# Altium project pay-optical.PrjPCB
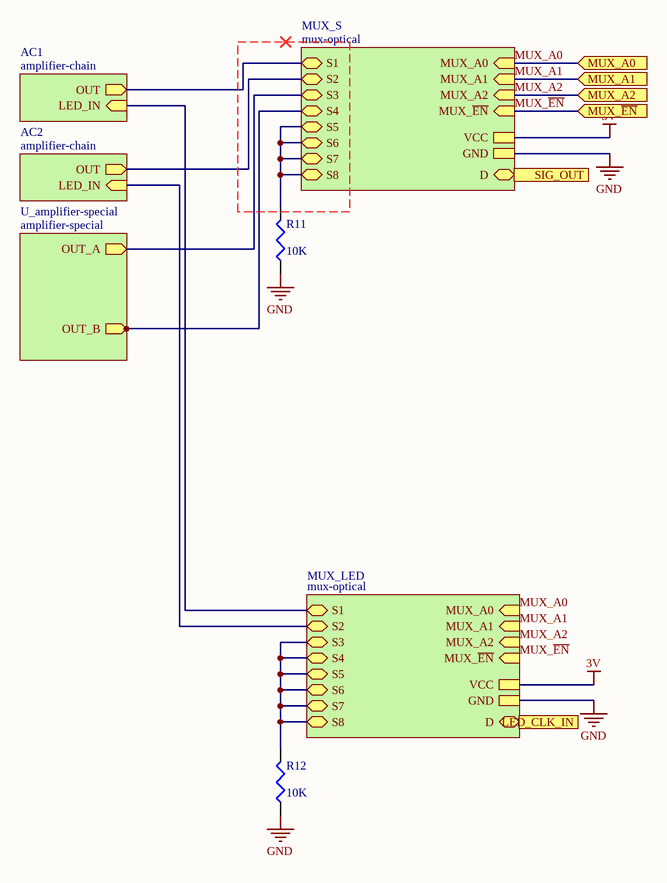
[diagram p0: filtering-optical-special.SchDoc]
4 sheets, 40 parts. Net scope: hierarchical (ports join the sheet entries above them; power ports are global).
Board file: pay-optical.PcbDoc
Sheets:
  filtering-optical-special.SchDoc
    AC1 = amplifier-chain.SchDoc
    AC2 = amplifier-chain.SchDoc
    MUX_LED = mux-optical.SchDoc
    MUX_S = mux-optical.SchDoc
    U_amplifier-special = amplifier-special.SchDoc

## Sheet filtering-optical-special.SchDoc
size A4

### Parts
R11  10K  [0402]
R12  10K  [0402]

### Sub-sheets
AC1 = amplifier-chain: OUT (out), LED_IN (in)
AC2 = amplifier-chain: OUT (out), LED_IN (in)
MUX_LED = mux-optical: MUX_A0 (in), MUX_A1 (in), MUX_A2 (in), MUX_~{EN} (in), VCC, GND, S1 (bidir), S2 (bidir), S3 (bidir), S4 (bidir), S5 (bidir), S6 (bidir), S7 (bidir), S8 (bidir), D (bidir)
MUX_S = mux-optical: MUX_A0 (in), MUX_A1 (in), MUX_A2 (in), MUX_~{EN} (in), VCC, GND, S1 (bidir), S2 (bidir), S3 (bidir), S4 (bidir), S5 (bidir), S6 (bidir), S7 (bidir), S8 (bidir), D (bidir)
U_amplifier-special = amplifier-special: OUT_B (out), OUT_A (out)

### Ports
LED_CLK_IN (in), MUX_A0 (in), MUX_A1 (in), MUX_A2 (in), MUX_~{EN} (in), SIG_OUT (out)

### Nets
3V: sheet MUX_LED/VCC, sheet MUX_S/VCC
GND: R11.1 R12.1 ; sheet MUX_LED/GND, sheet MUX_S/GND
MUX_A0: port MUX_A0, sheet MUX_LED/MUX_A0, sheet MUX_S/MUX_A0
MUX_A1: port MUX_A1, sheet MUX_LED/MUX_A1, sheet MUX_S/MUX_A1
MUX_A2: port MUX_A2, sheet MUX_LED/MUX_A2, sheet MUX_S/MUX_A2
MUX_~{EN}: port MUX_~{EN}, sheet MUX_LED/MUX_~{EN}, sheet MUX_S/MUX_~{EN}
NetC17_AC83_2: sheet AC2/OUT, sheet MUX_S/S2
NetC17_AC84_2: sheet AC1/OUT, sheet MUX_S/S1
NetC18_1: sheet MUX_S/S4, sheet U_amplifier-special/OUT_B
NetR8_AC83_1: sheet AC2/LED_IN, sheet MUX_LED/S2
NetR8_AC84_1: sheet AC1/LED_IN, sheet MUX_LED/S1
NetR11_2: R11.2 ; sheet MUX_S/S5, sheet MUX_S/S6, sheet MUX_S/S7, sheet MUX_S/S8
NetR12_2: R12.2 ; sheet MUX_LED/S3, sheet MUX_LED/S4, sheet MUX_LED/S5, sheet MUX_LED/S6, sheet MUX_LED/S7, sheet MUX_LED/S8
NetU3_1: sheet MUX_S/S3, sheet U_amplifier-special/OUT_A
NetU12_MUX_LED2_3: port SIG_OUT, sheet MUX_S/D
NetU12_MUX_S3_3: port LED_CLK_IN, sheet MUX_LED/D

### Library data of the parts
R11 R12 = Res3: Resistor; Published: 8-Jun-2000; LatestRevisionDate: 29-May-2009; LatestRevisionNote: IPC-7351 Footprint Added.; PackageReference: J1-0603; Publisher: Altium Limited; PackageDescription: Chip Resistor; Value: 10K

## Sheet amplifier-chain.SchDoc: AMPLIFIER-OPTICAL
size A4; DrawnBy: Dylan Vogel; Organization: UTAT SS; DocumentNumber: 7; Revision: 1; SheetNumber: 7; SheetTotal: 7
Used 2 times, as channels AC1, AC2. Parts and nets are listed once, with the designators drawn on the sheet.
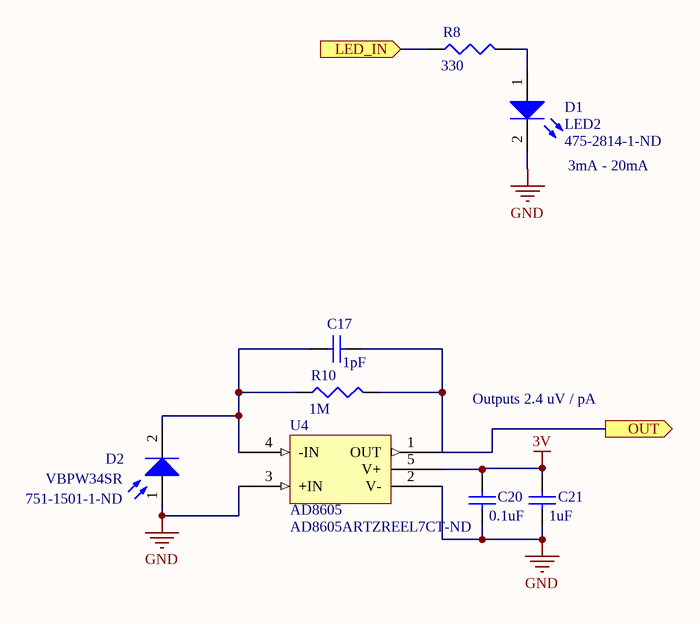
[diagram p1: amplifier-chain.SchDoc]

### Parts
C17  1pF  [0402]
C20  0.1uF  [0402]
C21  1uF  [1608[0603]]
D1  LED2  Supplier Part Number: 475-2814-1-ND  [LB P4SG]
D2  VBPW34SR  Supplier Part Number: 751-1501-1-ND  [VBPW34SR]
R8  330  [0402]
R10  1M  [J1-0603]
U4  AD8605  Supplier Part Number 1: AD8605ARTZREEL7CT-ND  [SOP-65P200X125-5N]

### Ports
LED_IN (in), OUT (out)

### Nets
3V: C20.2 C21.2 U4.5(V+)
GND: C20.1 C21.1 D1.2(K) D2.1(A) U4.2(V-) U4.3(+IN)
LED_IN: R8.1 ; port LED_IN
OUT: C17.2 R10.2 U4.1(OUT) ; port OUT
NetC17_1: C17.1 D2.2(K) R10.1 U4.4(-IN)
NetD1_1: D1.1(A) R8.2

### Channels
AC1: designators C17=C17_AC84 C20=C20_AC84 C21=C21_AC84 D1=D1_AC33 D2=D2_AC43 R8=R8_AC84 R10=R10_AC84 U4=U4_AC23; ports LED_IN=NetR8_AC84_1 OUT=NetC17_AC84_2
AC2: designators C17=C17_AC83 C20=C20_AC83 C21=C21_AC83 D1=D1_AC25 D2=D2_AC84 R8=R8_AC83 R10=R10_AC83 U4=U4_AC84; ports LED_IN=NetR8_AC83_1 OUT=NetC17_AC83_2

### Notes on the sheet
- (near D1) 3mA - 20mA
- Outputs 2.4 uV / pA

### Library data of the parts
C17 C20 C21 = Cap Semi: Capacitor (Semiconductor SIM Model); Published: 8-Jun-2000; LatestRevisionDate: 29-May-2009; LatestRevisionNote: IPC-7351 Footprint Added.; PackageReference: C1206; Publisher: Altium Limited; PackageDescription: Chip Capacitor; Supplier: Digi-Key
  C17: Value: 1pF
  C20: Value: 0.1uF
  C21: Value: 1uF
D1 = LED2: Typical RED, GREEN, YELLOW, AMBER GaAs LED; Published: 8-Jun-2000; LatestRevisionDate: 17-Jul-2002; LatestRevisionNote: Re-released for DXP Platform.; PackageVersion: Feb-2002; PackageReference: 3.2X1.6X1.1; Publisher: Altium Limited; PackageDescription: SM LED; 2 Flat Leads; Supplier: Digi-Key
D2 = Photo Sen: Photosensitive Diode; Published: 24-Mar-1999; LatestRevisionDate: 17-Jul-2002; LatestRevisionNote: Re-released for DXP Platform.; PackageReference: PIN2; Publisher: Altium Limited; Supplier: Digi-Key
R8 R10 = Res3: Resistor; Published: 8-Jun-2000; LatestRevisionDate: 29-May-2009; LatestRevisionNote: IPC-7351 Footprint Added.; PackageReference: J1-0603; Publisher: Altium Limited; PackageDescription: Chip Resistor; Supplier: Digi-Key
  R8: Value: 330
  R10: Value: 1M
U4 = AD8605: Low noise, precision rail-to-rail op-amp.; Supplier 1: Digi-Key; Supplier: Digi-Key

## Sheet mux-optical.SchDoc: MUX-OPTICAL
size A4; DrawnBy: Dylan Vogel; Organization: UTAT SS; DocumentNumber: 6; Revision: 1; SheetNumber: 6; SheetTotal: 7
Used 2 times, as channels MUX_LED, MUX_S. Parts and nets are listed once, with the designators drawn on the sheet.
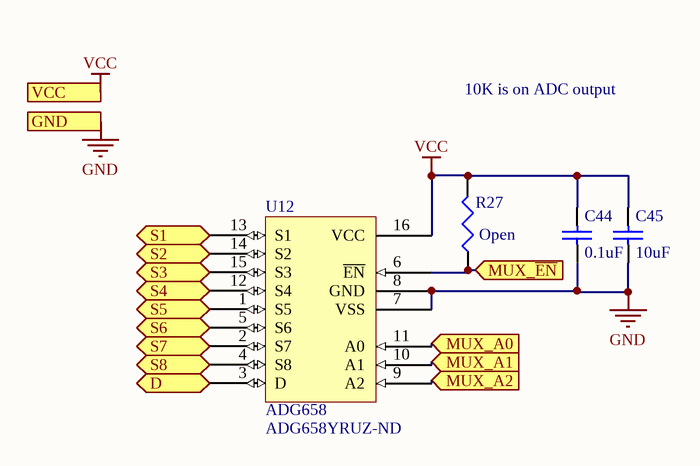
[diagram p2: mux-optical.SchDoc]

### Parts
C44  0.1uF  [0402]
C45  10uF  [1608[0603]]
R27  Open  [0402]
U12  ADG658  Supplier Part Number 1: ADG658YRUZ-ND  [SSOP16_N]

### Ports
D (bidir), GND, MUX_A0 (in), MUX_A1 (in), MUX_A2 (in), MUX_~{EN} (in), S1 (bidir), S2 (bidir), S3 (bidir), S4 (bidir), S5 (bidir), S6 (bidir), S7 (bidir), S8 (bidir), VCC

### Nets
GND: C44.1 C45.1 U12.7(VSS) U12.8(GND) ; port GND
VCC: C44.2 C45.2 R27.2 U12.16(VCC) ; port VCC
D: U12.3(D) ; port D
MUX_A0: U12.11(A0) ; port MUX_A0
MUX_A1: U12.10(A1) ; port MUX_A1
MUX_A2: U12.9(A2) ; port MUX_A2
MUX_~{EN}: R27.1 U12.6(~{EN}) ; port MUX_~{EN}
S1: U12.13(S1) ; port S1
S2: U12.14(S2) ; port S2
S3: U12.15(S3) ; port S3
S4: U12.12(S4) ; port S4
S5: U12.1(S5) ; port S5
S6: U12.5(S6) ; port S6
S7: U12.2(S7) ; port S7
S8: U12.4(S8) ; port S8

### Channels
MUX_LED: designators C44=C44_MUX_S4 C45=C45_MUX_LED4 R27=R27_MUX_S4 U12=U12_MUX_S3; ports D=NetU12_MUX_S3_3 GND=GND MUX_A0=MUX_A0 MUX_A1=MUX_A1 MUX_A2=MUX_A2 MUX_~{EN}=MUX_~{EN} S1=NetR8_AC84_1 S2=NetR8_AC83_1 S3=NetR12_2 S4=NetR12_2 S5=NetR12_2 S6=NetR12_2 S7=NetR12_2 S8=NetR12_2 VCC=3V
MUX_S: designators C44=C44_MUX_S5 C45=C45_MUX_S5 R27=R27_MUX_S2 U12=U12_MUX_LED2; ports D=NetU12_MUX_LED2_3 GND=GND MUX_A0=MUX_A0 MUX_A1=MUX_A1 MUX_A2=MUX_A2 MUX_~{EN}=MUX_~{EN} S1=NetC17_AC84_2 S2=NetC17_AC83_2 S3=NetU3_1 S4=NetC18_1 S5=NetR11_2 S6=NetR11_2 S7=NetR11_2 S8=NetR11_2 VCC=3V

### Notes on the sheet
- 10K is on ADC output

### Library data of the parts
C44 C45 = Cap Semi: Capacitor (Semiconductor SIM Model); Published: 8-Jun-2000; LatestRevisionDate: 29-May-2009; LatestRevisionNote: IPC-7351 Footprint Added.; PackageReference: C1206; Publisher: Altium Limited; PackageDescription: Chip Capacitor; Supplier: Digi-Key
  C44: Value: 0.1uF
  C45: Value: 10uF
R27 = Res3: Resistor; Published: 8-Jun-2000; LatestRevisionDate: 29-May-2009; LatestRevisionNote: IPC-7351 Footprint Added.; PackageReference: J1-0603; Publisher: Altium Limited; PackageDescription: Chip Resistor; Value: Open; Supplier: Digi-Key
U12 = ADG658: Eight channel analog multiplexer.; Supplier 1: Digi-Key; Supplier: Digi-Key

## Sheet amplifier-special.SchDoc
size A4
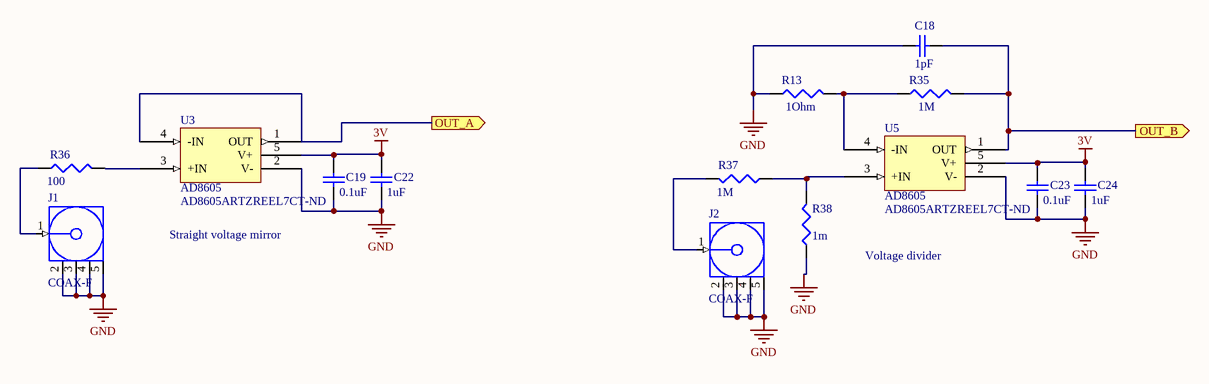
[diagram p3: amplifier-special.SchDoc]

### Parts
C18  value 1pF  [0402]  (hidden comment: 0.1uF)
C19  0.1uF  [0402]
C22  1uF  [1608[0603]]
C23  0.1uF  [0402]
C24  1uF  [1608[0603]]
J1  COAX-F  [MCX5.08-H5]
J2  COAX-F  [MCX5.08-H5]
R13  value 1Ohm  [J1-0603]  (hidden comment: 1 Ohm)
R35  1M  [0402]
R36  100  [0402]
R37  1M  [0402]
R38  1m  [14-1210]
U3  AD8605  Supplier Part Number 1: AD8605ARTZREEL7CT-ND  [SOP-65P200X125-5N]
U5  AD8605  Supplier Part Number 1: AD8605ARTZREEL7CT-ND  [SOP-65P200X125-5N]

### Ports
OUT_A (out), OUT_B (out)

### Nets
3V: C19.2 C22.2 C23.2 C24.2 U3.5(V+) U5.5(V+)
GND: C18.2 C19.1 C22.1 C23.1 C24.1 J1.2(GND) J1.3(GND) J1.4(GND) J1.5(GND) J2.2(GND) J2.3(GND) J2.4(GND) J2.5(GND) R13.1 R38.1 U3.2(V-) U5.2(V-)
NetC18_1: C18.1 R35.2 U5.1(OUT) ; port OUT_B
NetJ1_1: J1.1(Signal) R36.1
NetJ2_1: J2.1(Signal) R37.2
NetR13_2: R13.2 R35.1 U5.4(-IN)
NetR36_2: R36.2 U3.3(+IN)
NetR37_1: R37.1 R38.2 U5.3(+IN)
NetU3_1: U3.1(OUT) U3.4(-IN) ; port OUT_A

### Notes on the sheet
- Straight voltage mirror
- Voltage divider

### Library data of the parts
C18 C19 C22-C24 = Cap Semi: Capacitor (Semiconductor SIM Model); Published: 8-Jun-2000; LatestRevisionDate: 29-May-2009; LatestRevisionNote: IPC-7351 Footprint Added.; PackageReference: C1206; Publisher: Altium Limited; PackageDescription: Chip Capacitor; Supplier: Digi-Key
  C19 C23: Value: 0.1uF
  C22 C24: Value: 1uF
J1 J2 = COAX-F: RF Coaxial PCB Connector, MCX; Thru-Hole, Right-Angle Mount Socket, Blunt Post Terminal, 50 Ohm Impedance; PCB_Layout: Complies with manufacturer's recommendation.; DrillSize: Corresponds to nominal value.; Published: 15-Jul-2004; LatestRevisionDate: 15-Jul-2004; LatestRevisionNote: Component Replaced.; DatasheetDocument: 30-May-2003; PackageDocument: 04-Jul-1999; PackageReference: 919-119J-51AX; Publisher: Altium Limited; ComponentLink1Description: Manufacturer Link; ComponentLink1URL: http://www.amphenolrf.com/
R13 R35-R38 = Res3: Resistor; Published: 8-Jun-2000; LatestRevisionDate: 29-May-2009; LatestRevisionNote: IPC-7351 Footprint Added.; PackageReference: J1-0603; Publisher: Altium Limited; PackageDescription: Chip Resistor
  R35 R37: Value: 1M
  R36: Value: 100
  R38: Value: 1m
U3 U5 = AD8605: as U4 on sheet amplifier-chain; Supplier 1: Digi-Key; Supplier: Digi-Key

## Nets that join several sheets
3V: AC1 (C20_AC84.2 C21_AC84.2 U4_AC23.5), AC2 (C20_AC83.2 C21_AC83.2 U4_AC84.5), MUX_LED (C44_MUX_S4.2 C45_MUX_LED4.2 R27_MUX_S4.2 U12_MUX_S3.16), MUX_S (C44_MUX_S5.2 C45_MUX_S5.2 R27_MUX_S2.2 U12_MUX_LED2.16), amplifier-special (6 pins)
GND: filtering-optical-special (R11.1 R12.1), AC1 (6 pins), AC2 (6 pins), MUX_LED (C44_MUX_S4.1 C45_MUX_LED4.1 U12_MUX_S3.7 U12_MUX_S3.8), MUX_S (C44_MUX_S5.1 C45_MUX_S5.1 U12_MUX_LED2.7 U12_MUX_LED2.8), amplifier-special (17 pins)
MUX_A0: MUX_LED (U12_MUX_S3.11), MUX_S (U12_MUX_LED2.11)
MUX_A1: MUX_LED (U12_MUX_S3.10), MUX_S (U12_MUX_LED2.10)
MUX_A2: MUX_LED (U12_MUX_S3.9), MUX_S (U12_MUX_LED2.9)
MUX_~{EN}: MUX_LED (R27_MUX_S4.1 U12_MUX_S3.6), MUX_S (R27_MUX_S2.1 U12_MUX_LED2.6)
NetC17_AC83_2: AC2 (C17_AC83.2 R10_AC83.2 U4_AC84.1), MUX_S (U12_MUX_LED2.14)
NetC17_AC84_2: AC1 (C17_AC84.2 R10_AC84.2 U4_AC23.1), MUX_S (U12_MUX_LED2.13)
NetC18_1: MUX_S (U12_MUX_LED2.12), amplifier-special (C18.1 R35.2 U5.1)
NetR8_AC83_1: AC2 (R8_AC83.1), MUX_LED (U12_MUX_S3.14)
NetR8_AC84_1: AC1 (R8_AC84.1), MUX_LED (U12_MUX_S3.13)
NetR11_2: filtering-optical-special (R11.2), MUX_S (U12_MUX_LED2.1 U12_MUX_LED2.2 U12_MUX_LED2.4 U12_MUX_LED2.5)
NetR12_2: filtering-optical-special (R12.2), MUX_LED (6 pins)
NetU3_1: MUX_S (U12_MUX_LED2.15), amplifier-special (U3.1 U3.4)